# EAGLE design ESP-Live (EAGLE 7.7.0)
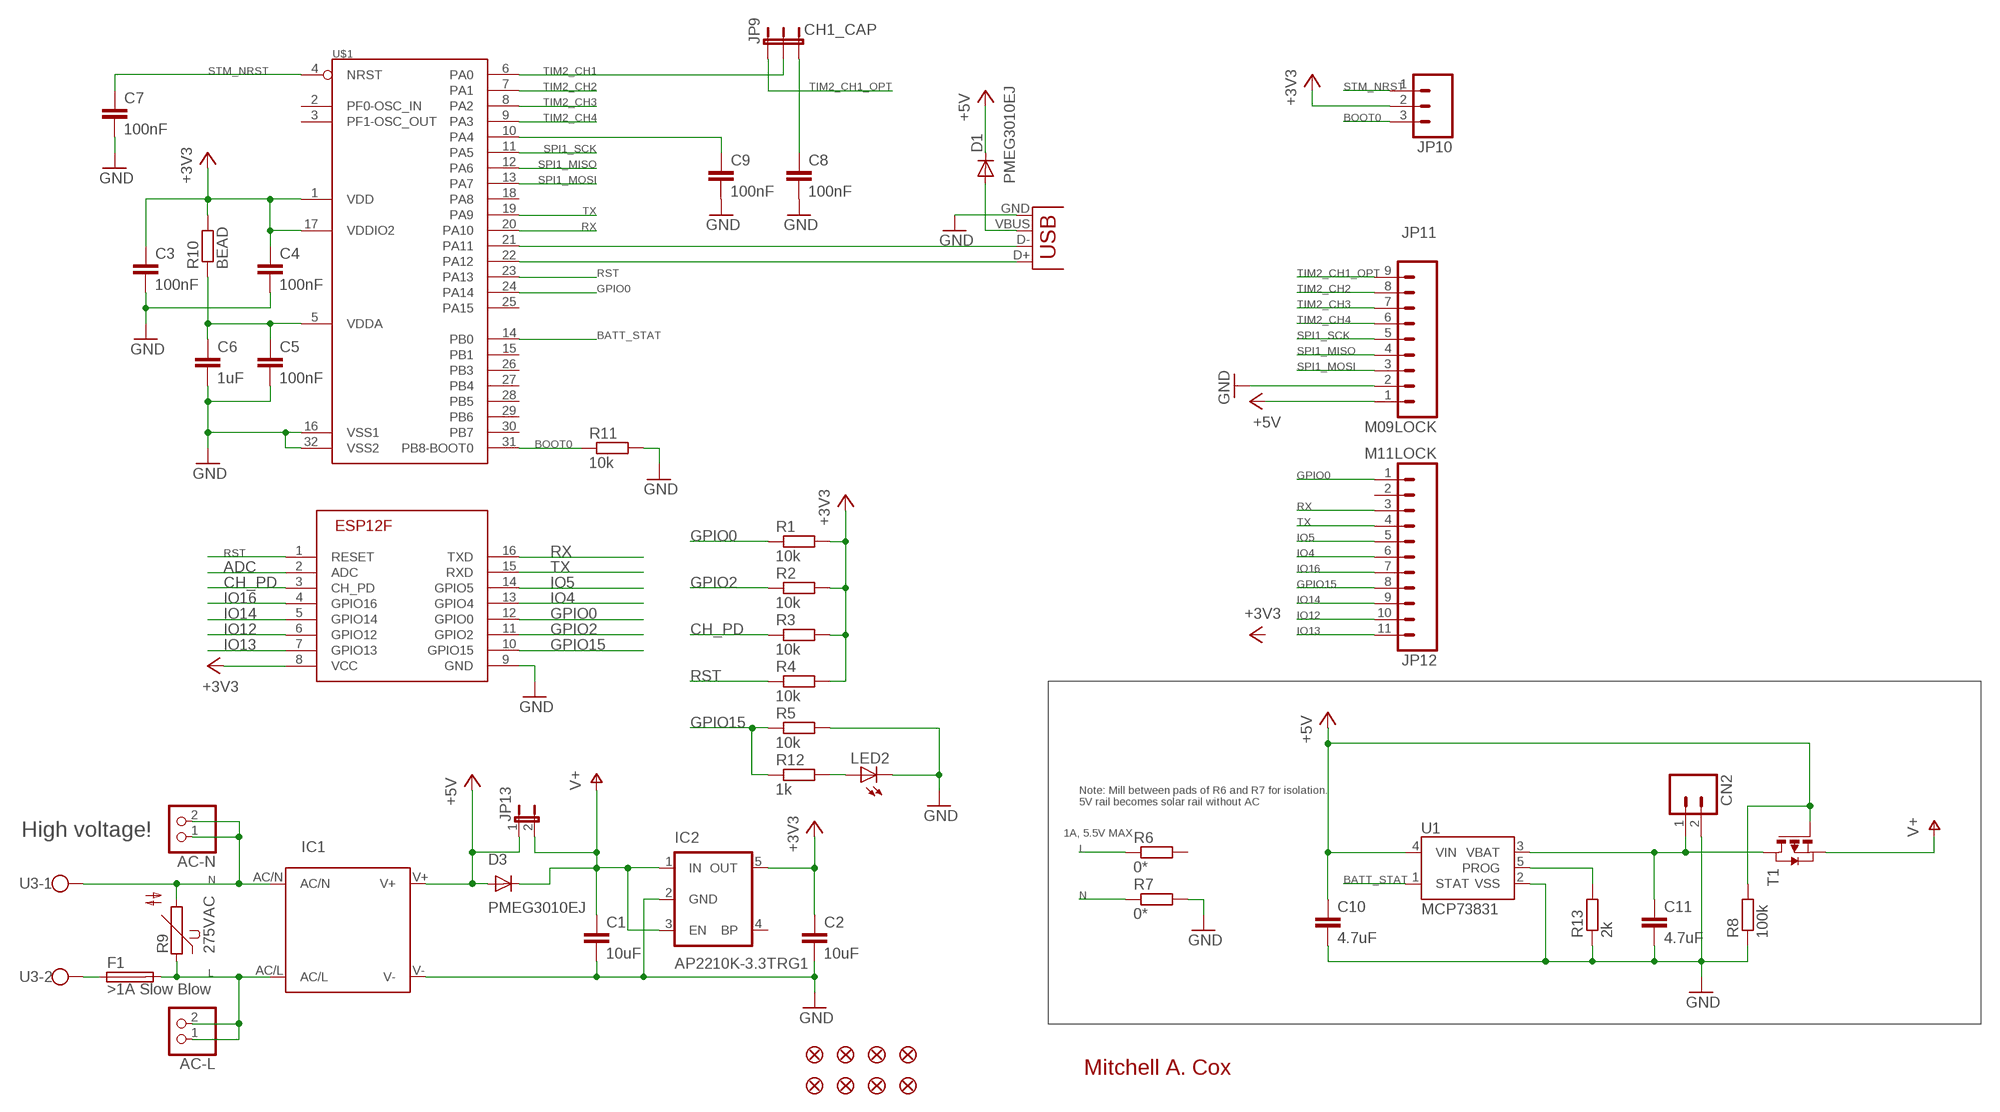
[diagram p0: schematic, sheet 1]

## Parts
AC-L  PINHD-1X2  [1X02]
AC-N  PINHD-1X2  [1X02]
C1  10uF  C-EUC0805  [C0805]
C2  10uF  C-EUC0805  [C0805]
C3  100nF  C-EUC0603  [C0603]
C4  100nF  C-EUC0603  [C0603]
C5  100nF  C-EUC0603  [C0603]
C6  1uF  C-EUC0805  [C0805]
C7  100nF  C-EUC0603  [C0603]
C8  100nF  C-EUC0603  [C0603]
C9  100nF  C-EUC0603  [C0603]
C10  4.7uF  C-EUC0805  [C0805]
C11  4.7uF  C-EUC0805  [C0805]
CN1  USBSMD  [USB-MINIB]
CN2  M02-JST-2-PTH-NO_SILK  [JST-2-PTH-NS]
D1  PMEG3010EJ  DIODESOD  [SOD-323]
D3  PMEG3010EJ  DIODESOD  [SOD-323]
F1  >1A Slow Blow  TE5  [TE5]
IC1  IRM_01/02_SMDIRM_01/02_SMD  [IRM_01/02_SMD]
IC2  AP2210K-3.3TRG1  V_REG_LDOSMD  [SOT23-5]
IC3  ESP-12F  [ESP-12F]
JP1  FIDUCIAL1X2  [FIDUCIAL-1X2]
JP2  FIDUCIAL1X2  [FIDUCIAL-1X2]
JP3  FIDUCIAL1X2  [FIDUCIAL-1X2]
JP4  FIDUCIAL1X2  [FIDUCIAL-1X2]
JP5  FIDUCIAL1X2  [FIDUCIAL-1X2]
JP6  FIDUCIAL1X2  [FIDUCIAL-1X2]
JP7  FIDUCIAL1X2  [FIDUCIAL-1X2]
JP8  FIDUCIAL1X2  [FIDUCIAL-1X2]
JP9  CH1_CAP  JUMPER-31-2  [SJ_3_PASTE1&2]
JP10  M03LOCK  [1X03_LOCK]
JP11  M09LOCK  [1X09_LOCK]
JP12  M11LOCK  [1X11_LOCK]
JP13  JUMPER-2SMD-NO  [SJ_2S-NO]
LED2  LEDCHIPLED_0805  [CHIPLED_0805]
R1  10k  R-EU_R0603  [R0603]
R2  10k  R-EU_R0603  [R0603]
R3  10k  R-EU_R0603  [R0603]
R4  10k  R-EU_R0603  [R0603]
R5  10k  R-EU_R0603  [R0603]
R6  0*  R-EU_R2512  [R2512]
R7  0*  R-EU_R2512  [R2512]
R8  100k  R-EU_R0603  [R0603]
R9  275VAC  P593  [P593]
R10  BEAD  R-EU_R0603  [R0603]
R11  10k  R-EU_R0603  [R0603]
R12  1k  R-EU_R0603  [R0603]
R13  2k  R-EU_R0603  [R0603]
T1  PMOSSOT23  [SOT-23]
U1  MCP73831  [SOT23-5]
U3  W237-102  [W237-102]
U$1  STM32F042K  [LQFP32]

## Nets
+3V3: C2.1 C3.1 C4.1 IC2.5(OUT) IC3.8(VCC) JP10.2 R1.2 R2.2 R3.2 R4.2 R10.2 U$1.1(VDD) U$1.17(VDDIO2)
+5V: C10.1 D1.1(C) D3.2(A) IC1.V+ JP11.1 JP13.1 R8.2 T1.3(G) U1.4(VIN)
ADC: IC3.2(ADC)
BATT_STAT: U1.1(STAT) U$1.14(PB0)
BOOT0: JP10.3 R11.1 U$1.31(PB8-BOOT0)
CH_PD: IC3.3(CH_PD) R3.1
GND: C1.2 C2.2 C3.2 C4.2 C5.2 C6.2 C7.2 C8.2 C9.2 C10.2 C11.2 CN1.GND CN2.2 IC1.V- IC2.2(GND) IC3.9(GND) JP11.2 LED2.C R5.2 R7.2 R8.1 R11.2 R13.1 U1.2(VSS) U$1.16(VSS1) U$1.32(VSS2)
GPIO0: IC3.12(GPIO0) JP12.1 R1.1 U$1.24(PA14)
GPIO2: IC3.11(GPIO2) R2.1
GPIO15: IC3.10(GPIO15) JP12.8 R5.1 R12.1
IO4: IC3.13(GPIO4) JP12.6
IO5: IC3.14(GPIO5) JP12.5
IO12: IC3.6(GPIO12) JP12.10
IO13: IC3.7(GPIO13) JP12.11
IO14: IC3.5(GPIO14) JP12.9
IO16: IC3.4(GPIO16) JP12.7
L: AC-L.1 AC-L.2 F1.2 IC1.AC/L R6.1 R9.1
N: AC-N.1 AC-N.2 IC1.AC/N R7.1 R9.2 U3.1
N$1: F1.1 U3.2
N$2: C5.1 C6.1 R10.1 U$1.5(VDDA)
N$3: R13.2 U1.5(PROG)
N$6: CN1.D- U$1.21(PA11)
N$7: CN1.D+ U$1.22(PA12)
N$9: CN1.VBUS D1.2(A)
N$10: LED2.A R12.2
N$11: C9.1 U$1.10(PA4)
N$12: C8.1 JP9.3
N$13: C11.1 CN2.1 T1.1(D) U1.3(VBAT)
RST: IC3.1(RESET) R4.1 U$1.23(PA13)
RX: IC3.16(TXD) JP12.3 U$1.20(PA10)
SPI1_MISO: JP11.4 U$1.12(PA6)
SPI1_MOSI: JP11.3 U$1.13(PA7)
SPI1_SCK: JP11.5 U$1.11(PA5)
STM_NRST: C7.1 JP10.1 U$1.4(NRST)
TIM2_CH1: JP9.2 U$1.6(PA0)
TIM2_CH1_OPT: JP9.1 JP11.9
TIM2_CH2: JP11.8 U$1.7(PA1)
TIM2_CH3: JP11.7 U$1.8(PA2)
TIM2_CH4: JP11.6 U$1.9(PA3)
TX: IC3.15(RXD) JP12.4 U$1.19(PA9)
V+: C1.1 D3.1(C) IC2.1(IN) IC2.3(EN) JP13.2 T1.2(S)
Unconnected: IC2.4(BP) JP12.2 R6.2 U$1.2(PF0-OSC_IN) U$1.3(PF1-OSC_OUT) U$1.15(PB1) U$1.18(PA8) U$1.25(PA15) U$1.26(PB3) U$1.27(PB4) U$1.28(PB5) U$1.29(PB6) U$1.30(PB7)

## Notes on the sheet
- Note: Mill between pads of R6 and R7 for isolation.
  5V rail becomes solar rail without AC
- High voltage! | 1A, 5.5V MAX
- Mitchell A. Cox

## Library data of the parts
AC-L AC-N = pinhead:PINHD-1X2: PIN HEADER
C1-C11 = rcl:C-EU: CAPACITOR, European symbol
CN1 = SparkFun:USB: USB Connectors USB-B-PTH is fully proven SKU : PRT-00139 USB-miniB is fully proven SKU : PRT-00587 USB-A-PCB is untested. USB-A-H is throughly reviewed, but untested. Spark Fun Electronics SKU : PRT-00437 USB-B-SMT is throughly reviewed, but untested. Needs silkscreen touching up. USB-A-S has not been used/tested USB-MB-H has not been used/tested
CN2 = SparkFun:M02: Header 2 Standard 2-pin 0.1" header. Use with straight break away headers (SKU : PRT-00116), right angle break away headers (PRT-00553), swiss pins (PRT-00743), machine pins (PRT-00117), and female headers (PRT-00115). Molex polarized connector foot print use with SKU : PRT-08233 with associated crimp pins and housings.
D1 D3 = SparkFun:DIODE: Diode These are standard reverse protection diodes and small signal diodes. SMA package can handle up to about 1A. SOD-323 can handle about 200mA. What the SOD-323 package when ordering, there are some mfgs out there that are 5-pin packages.
F1 = fuse:TE5: FUSE Wickmann; OC_FARNELL: unknown; OC_NEWARK: unknown
IC1 = meanwell_irm_v7:IRM_01/02_SMD: 1 or 2 watt housing & pin compatible IRM 01 Vout [V] Imax [A] Pmax [W] Eff [%] 3.3 0.3 1 66 5 0.2 1 70 9 0.111 1 72 12 0.083 1 74 15 0.067 1 75 24 0.042 1 77 IRM 2 Vout [V] Imax [A] Pmax [W] Eff [%] 3.3 0.6 2 66 5 0.4 2 70 9 0.222 2 72 12 0.167 2 74 15 0.133 2 75 24 0.087 2 77
IC2 = SparkFun:V_REG_LDO: Voltage Regulator LDO Standard 150mA LDO voltage regulator in SOT-23 layout. Micrel part MIC5205. BP (by-pass) pin is used to lower output noise with 470pF cap.
IC3 = adafruit:ESP-12F
JP1-JP8 = SparkFun:FIDUCIAL: Fiducial Alignment Points Various fiducial points for machine vision alignment.
JP9 = SparkFun:JUMPER-3
JP10 = SparkFun:M03: Header 3 Standard 3-pin 0.1" header. Use with straight break away headers (SKU : PRT-00116), right angle break away headers (PRT-00553), swiss pins (PRT-00743), machine pins (PRT-00117), and female headers (PRT-00115). Molex polarized connector foot print use with SKU : PRT-08232 with associated crimp pins and housings.
JP11 = SparkFun:M09: Header 9 Standard 9-pin 0.1" header. Use with straight break away headers (SKU : PRT-00116), right angle break away headers (PRT-00553), swiss pins (PRT-00743), machine pins (PRT-00117), and female headers (PRT-00115).
JP12 = SparkFun:M11: Header 11 Standard 11-pin 0.1" header. Use with straight break away headers (SKU : PRT-00116), right angle break away headers (PRT-00553), swiss pins (PRT-00743), machine pins (PRT-00117), and female headers (PRT-00115).
JP13 = SparkFun:JUMPER-2: Jumper Basic 0.1" spaced jumper. Use with breakaway headers.
LED2 = adafruit:LED: LED OSRAM: - CHIPLED LG R971, LG N971, LY N971, LG Q971, LY Q971, LO R971, LY R971 LH N974, LH R974 LS Q976, LO Q976, LY Q976 LO Q996 - Hyper CHIPLED LW Q18S LB Q993, LB Q99A, LB R99A - SideLED LS A670, LO A670, LY A670, LG A670, LP A670 LB A673, LV A673, LT A673, LW A673 LH A674 LY A675 LS A676, LA A676, LO A676, LY A676, LW A676 LS A679, LY A679, LG A679 - Hyper Micro SIDELED® LS Y876, LA Y876, LO Y876, LY Y876 LT Y87S - SmartLED LW L88C, LW L88S LB L89C, LB L89S, LG L890 LS L89K, LO L89K, LY L89K LS L896, LA L896, LO L896, LY L896 - TOPLED LS T670, LO T670, LY T670, LG T670, LP T670 LSG T670, LSP T670, LSY T670, LOP T670, LYG T670 LG T671, LOG T671, LSG T671 LB T673, LV T673, LT T673, LW T673 LH T674 LS T676, LA T676, LO T676, LY T676, LB T676, LH T676, LSB T676, LW T676 LB T67C, LV T67C, LT T67C, LS T67K, LO T67K, LY T67K, LW E67C LS E67B, LA E67B, LO E67B, LY E67B, LB E67C, LV E67C, LT E67C LW T67C LS T679, LY T679, LG T679 LS T770, LO T770, LY T770, LG T770, LP T770 LB T773, LV T773, LT T773, LW T773 LH T774 LS E675, LA E675, LY E675, LS T675 LS T776, LA T776, LO T776, LY T776, LB T776 LHGB T686 LT T68C, LB T68C - Hyper Mini TOPLED® LB M676 - Mini TOPLED Santana® LG M470 LS M47K, LO M47K, LY M47K Source: http://www.osram.convergy.de/
R1-R8 R10-R13 = rcl:R-EU_: RESISTOR, European symbol
R9 = varistor:P593: VARISTOR
T1 = zetex:PMOSSOT23: MOS FET; OC_FARNELL: unknown; OC_NEWARK: unknown
U1 = SparkFun:MCP73831: Microchip's MCP73831 Miniature single cell, fully integrated Li-Ion, Li-polymer charge management controller http://ww1.microchip.com/downloads/en/DeviceDoc/21984a.pdf
U3 = con-wago-500:W237-102: WAGO SCREW CLAMP; MPN: 237-102; OC_FARNELL: unknown; OC_NEWARK: 70K9898
U$1 = stm32:STM32F042K

## Board
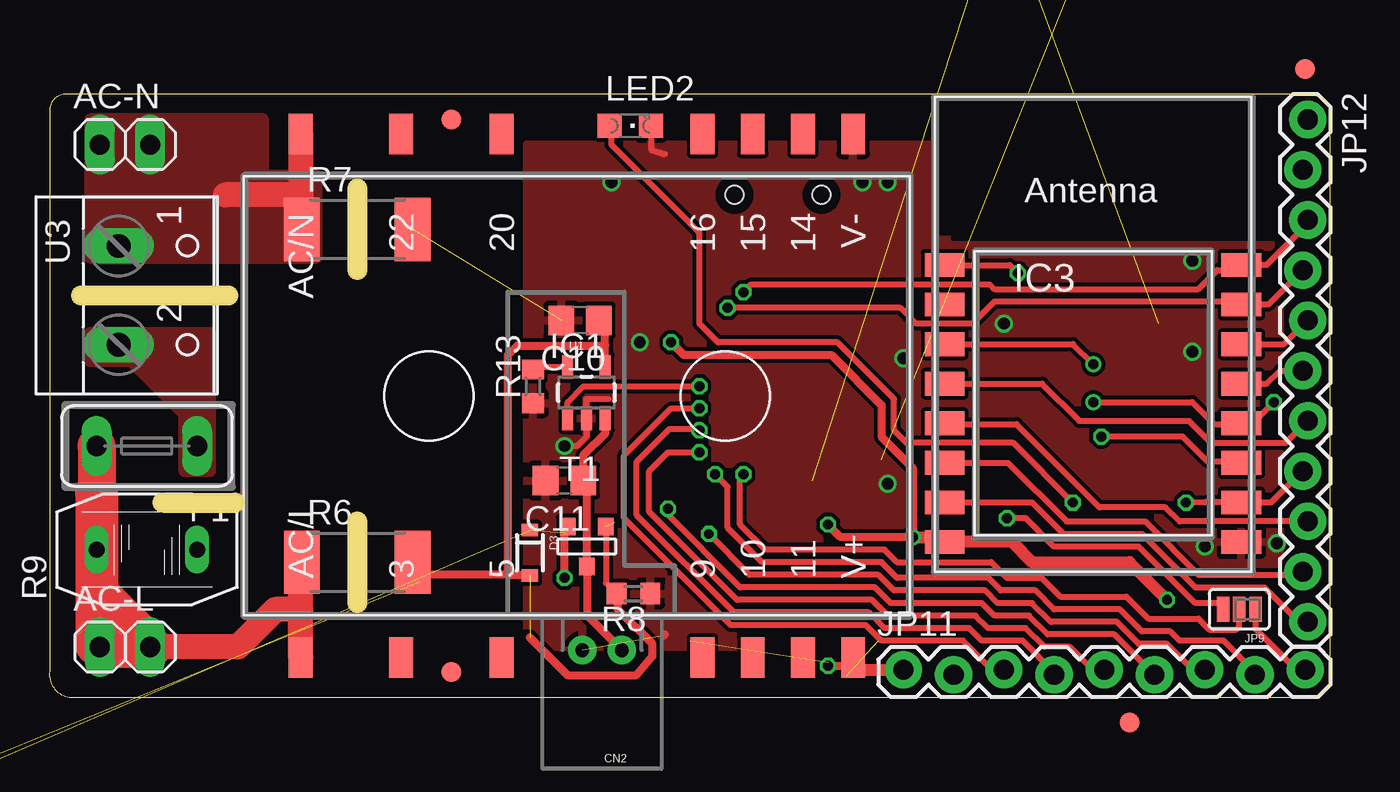
[diagram p1: board, top side]
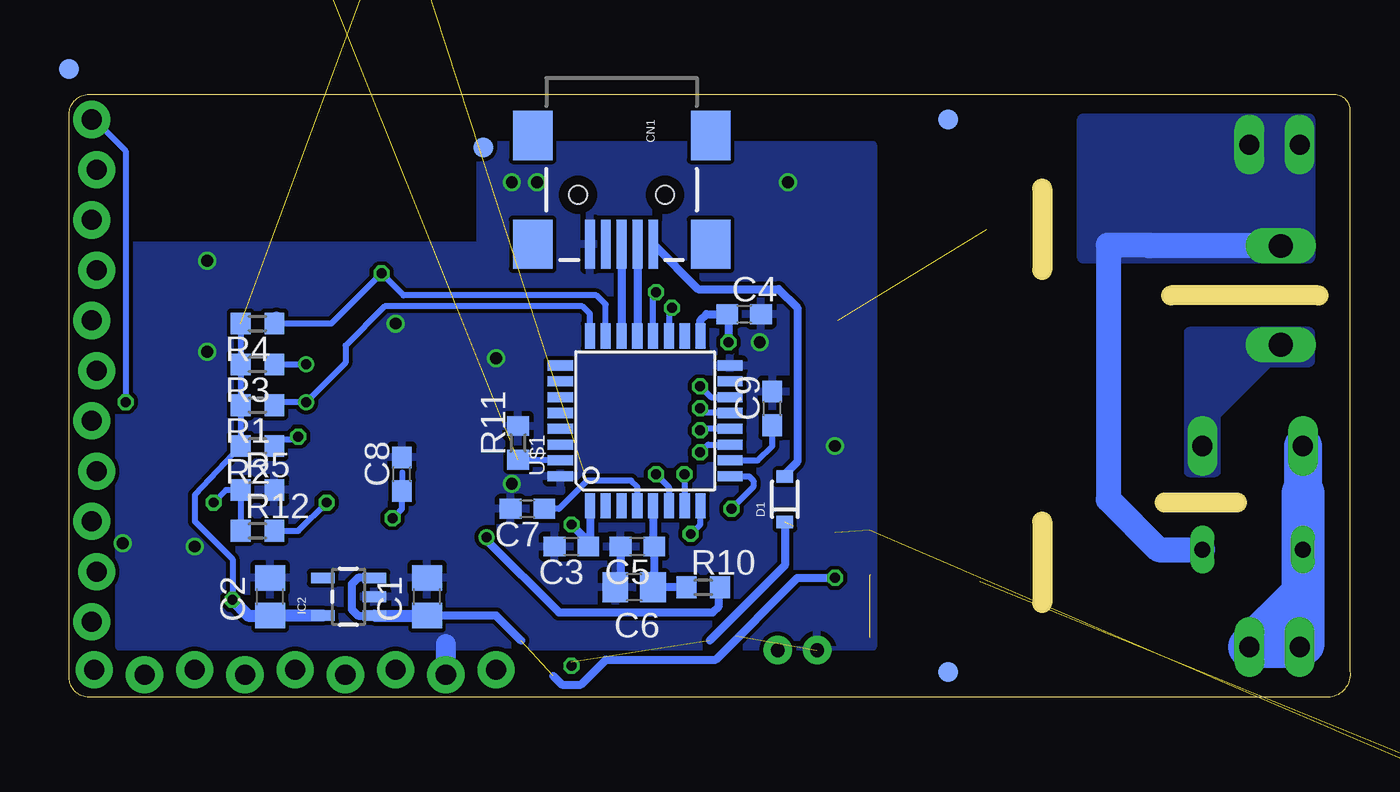
[diagram p2: board, bottom side, seen from below]

Size 64.78 x 30.49 mm. Coordinates in mm from the lower left corner, seen from the top.
Outline: 63.78,30.48 1.01,30.48 arc90 0.01,29.8 0.01,1.32 arc90 1.01,0 63.78,0 arc90 64.78,1 64.78,29.48 arc90 63.78,30.48
Copper layers (1*16): Top 0.035mm / dielectric 1.6mm / Bottom 0.035mm
Design rules "Elecrow_2-layer_PCB_eagle_rule *": minimum track width 6mil, minimum drill 12mil, track to track 8mil, track to pad 8mil, pad to pad 8mil, via to via 8mil, smd to smd 0mil, copper to edge 20mil, drill to drill 12mil, minimum pad ring 6mil, minimum via ring 6mil, stop-mask expansion 0mil, vias tented up to drill 100mil, thermal gap 10mil
tKeepout: area -4.3,14.6 to -1.3,17.6
Milling: 4 lines

### Footprints (pad centres in the part's own frame; a part is rotated, then mirrored left to right if it is on the bottom)
1X02 = drill 1.016 long: 1 -1.27,0; 2 1.27,0
C0805 = smd 1.3 x 1.5: 1 -0.95,0; 2 0.95,0
C0603 = smd 1.1 x 1: 1 -0.85,0; 2 0.85,0
USB-MINIB = smd 2.5 x 0.5: D+ 2.5,0; D- 2.5,0.8; GND 2.5,-1.6; ID 2.5,-0.8; VBUS 2.5,1.6 | smd 2.5 x 2: MTN1 -3,4.5; MTN2 2.5,4.5; MTN3 -3,-4.5; MTN4 2.5,-4.5 | hole 0.9: 0,2.2; 0,-2.2
JST-2-PTH-NS = drill 0.7 pad 1.448: 1 -1,0; 2 1,0
SOD-323 = smd 0.63 x 0.83: 1 -1.15,0; 2 1.15,0
TE5 = drill 1.016 long: 1 -2.54,0; 2 2.54,0
IRM_01/02_SMD = smd 1.2 x 2.03: AC/L -13.97,-13.235; AC/N -13.97,13.235; P$3 -8.89,-13.235; P$5 -3.81,-13.235; P$9 6.35,-13.235; P$10 8.89,-13.235; P$11 11.43,-13.235; P$14 11.43,13.235; P$15 8.89,13.235; P$16 6.35,13.235; P$20 -3.81,13.235; P$22 -8.89,13.235; V+ 13.97,-13.235; V- 13.97,13.235
SOT23-5 = smd 0.55 x 1.2: 1 -0.95,-1.3; 2 0,-1.3; 3 0.95,-1.3; 4 0.95,1.3; 5 -0.95,1.3
ESP-12F = smd 2 x 1.2: 1 0.5,15.5; 2 0.5,13.5; 3 0.5,11.5; 4 0.5,9.5; 5 0.5,7.5; 6 0.5,5.5; 7 0.5,3.5; 8 0.5,1.5; 9 15.5,1.5; 10 15.5,3.5; 11 15.5,5.5; 12 15.5,7.5; 13 15.5,9.5; 14 15.5,11.5; 15 15.5,13.5; 16 15.5,15.5
FIDUCIAL-1X2 = smd 1 x 1: 1 0,0
SJ_3_PASTE1&2 = smd 0.635 x 1.27: 1 -0.813,0; 2 0,0; 3 0.813,0
1X03_LOCK = drill 1.016 pad 1.88: 1 0,0.127; 2 2.54,-0.127; 3 5.08,0.127
1X09_LOCK = drill 1.016 pad 1.88: 1 0,0.127; 2 2.54,-0.127; 3 5.08,0.127; 4 7.62,-0.127; 5 10.16,0.127; 6 12.7,-0.127; 7 15.24,0.127; 8 17.78,-0.127; 9 20.32,0.127
1X11_LOCK = drill 1.016 pad 1.88: 1 0,0.127; 2 2.54,-0.127; 3 5.08,0.127; 4 7.62,-0.127; 5 10.16,0.127; 6 12.7,-0.127; 7 15.24,0.127; 8 17.78,-0.127; 9 20.32,0.127; 10 22.86,-0.127; 11 25.4,0.127
SJ_2S-NO = smd 0.635 x 1.27: 1 -0.45,0; 2 0.45,0
CHIPLED_0805 = smd 1.2 x 1.2: A 0,-1.05; C 0,1.05
R0603 = smd 1 x 1.1: 1 -0.85,0; 2 0.85,0
R2512 = smd 1.8 x 3.2: 1 -2.8,0; 2 2.8,0
P593 = drill 0.813 long: 1 0,2.54; 2 0,-2.54
SOT-23 = smd 0.787 x 0.889: 1 0.025,-1.016; 2 -0.94,1.016; 3 0.991,1.016
W237-102 = drill 1.194 long: 1 -2.5,-1.27; 2 2.5,-1.27
LQFP32 = smd 1.27 x 0.508: 1 -4.293,2.8; 2 -4.293,2; 3 -4.293,1.2; 4 -4.293,0.4; 5 -4.293,-0.4; 6 -4.293,-1.2; 7 -4.293,-2; 8 -4.293,-2.8; 17 4.293,-2.8; 18 4.293,-2; 19 4.293,-1.2; 20 4.293,-0.4; 21 4.293,0.4; 22 4.293,1.2; 23 4.293,2; 24 4.293,2.8 | smd 0.508 x 1.27: 9 -2.8,-4.293; 10 -2,-4.293; 11 -1.2,-4.293; 12 -0.4,-4.293; 13 0.4,-4.293; 14 1.2,-4.293; 15 2,-4.293; 16 2.8,-4.293; 25 2.8,4.293; 26 2,4.293; 27 1.2,4.293; 28 0.4,4.293; 29 -0.4,4.293; 30 -1.2,4.293; 31 -2,4.293; 32 -2.8,4.293

### Placement (x,y rotation side)
AC-L  3.82,2.54 0 top
AC-N  3.82,27.94 0 top
C1  46.68,5.08 90 bottom
C2  54.62,5.08 90 bottom
C3  39.38,7.62 180 bottom
C4  30.65,19.37 0 bottom
C5  36.05,7.62 180 bottom
C6  36.2,5.56 180 bottom
C7  41.6,9.53 180 bottom
C8  47.95,11.27 90 bottom
C9  29.22,14.6 90 bottom
C10  26.84,19.05 180 top
C11  26.04,10.95 180 top
CN1  36.84,25.4 270 bottom
CN2  27.95,2.38 180 top
D1  28.58,10 90 bottom
D3  24.3,7.3 270 top
F1  4.93,12.7 180 top
IC1  26.68,15.24 0 top
IC2  50.65,5.08 90 bottom
IC3  44.78,6.35 0 top
JP1  20.33,1.27 0 top
JP2  20.33,29.21 0 top
JP3  63.51,31.75 0 top
JP4  54.62,-1.27 0 top
JP5  64.78,31.75 0 bottom
JP6  20.33,29.21 0 bottom
JP7  43.82,27.78 0 bottom
JP8  20.33,1.27 0 bottom
JP9  60.18,4.45 180 top
JP10  47,36.83 0 top  (outside the outline)
JP11  43.19,1.27 0 top
JP12  63.51,29.21 270 top
JP13  -7.61,-5.08 0 top  (outside the outline)
LED2  29.38,28.89 270 top
R1  55.25,14.76 180 bottom
R2  55.25,12.7 180 bottom
R3  55.25,16.83 180 bottom
R4  55.25,18.89 180 bottom
R5  55.25,10.48 0 bottom
R6  15.57,6.83 0 top
R7  15.57,23.65 0 top
R8  29.54,5.24 180 top
R9  4.93,7.46 90 top
R10  32.71,5.56 0 bottom
R11  42.08,12.86 90 bottom
R12  55.25,8.41 0 bottom
R13  24.46,15.72 90 top
T1  27.16,7.62 0 top
U1  27.16,15.4 0 top
U3  4.77,20.32 270 top
U$1  35.65,13.97 90 bottom

### Tracks (layer width: path | path; a pad name or v marks a point on that pad's centre or on a via)
+3V3  (via drill 0.5)  (1 unrouted)
  Top 0.406: v31.44,17.94 32.08,17.3 39.54,17.3 42.08,14.76 42.08,13.18 43.67,11.59 v43.67,8.1 40.01,8.1 v39.38,8.73
  Top 0.61: v56.52,4.92 54.62,6.83 49.7,6.83 48.67,7.85 IC3.8 45.03,8.1 v43.67,8.1
  Bottom 0.305: R4.2 R3.2 R1.2 R2.2 58.43,10.22 58.43,8.89 56.52,6.98 v56.52,4.92
  Bottom 0.406: v43.67,8.1 43.67,7.94 40.01,4.29 32.24,4.29 31.92,4.6 31.92,5.5 R10.2 | U$1.17 32.85,19.07 32.55,19.37 C4.1 31.44,19.31 v31.44,17.94 | 38.45,7.7 38.51,7.7 | U$1.1 38.45,7.7 | 38.45,7.7 C3.1 38.53,7.88 v39.38,8.73
  Bottom 0.61: IC2.5 C2.1 55.73,4.13 v56.52,4.92
+5V  (via drill 0.5)  (5 unrouted)
  Top 0.305: T1.3 28.15,5.78 R8.2
  Top 0.406: v39.38,1.59 40.43,1.59 40.78,1.4 | U1.4 28.11,17.78 | 28.11,17.78 28.11,18.73 C10.1 | 18.72,5.83 18.6,6.18 18.6,6.19 23.19,6.19 | 23.19,6.19 23.19,17.3 23.66,17.78 28.11,17.78 | 24.3,3.02 26.2,1.11 29.7,1.11 30.49,2.06 30.49,2.7 28.74,4.45 28.74,5.24 R8.2 | 23.19,6.19 24.26,6.19
  Top 0.61: IC1.V+ 40.78,1.4 JP11.1
  Bottom 0.406: 43.16,1.43 JP11.1 | D1.1 28.58,6.67 32.39,2.86 | 39.41,1.77 v39.38,1.59
BATT_STAT  (via drill 0.5)
  Top 0.305: U1.1 26.21,14.92 27,15.72 v32.87,15.72
  Bottom 0.305: v32.87,15.72 32.32,15.17 U$1.14
BOOT0  (1 unrouted)
  Bottom 0.305: U$1.31 42.04,11.97 R11.1
CH_PD  (via drill 0.5)
  Top 0.305: IC3.3 51.77,17.85 v52.79,16.83
  Bottom 0.305: R3.1 v52.79,16.83
GND  (via drill 0.6)  (2 unrouted)
  Top 0.305: LED2.C 30.43,27.68 31.12,27.46 | v26.04,12.7 26.68,12.7 27.16,13.18 U1.2 27.16,15.08 28.27,15.08
  Top 0.406: 31.06,3.11 31.12,3.18
  Top 0.813: 60.75,7.69 IC3.9
  Bottom 0.406: C5.2 36.9,5.81 C6.2
  Bottom 1.016: JP11.2 45.73,2.7
  other vias: 58.43,7.62 62.08,7.78 57.79,17.46 48.27,18.89 57.79,22.07 41.13,26.04 42.4,26.04 43.19,17.14 29.85,17.94 28.43,26.04 42.4,10.79
  pour Bottom: 24.14,27.94 24.14,2.54 62.24,2.54 62.24,22.86 43.98,22.86 43.98,27.94
  pour Top: 24.14,27.94 24.14,2.54 62.24,2.54 62.24,22.86 45.41,22.86 45.41,27.94
GPIO0  (via drill 0.5)
  Top 0.305: v52.79,14.92 57.79,14.92 58.91,13.81 60.56,13.81 | 60.56,13.81 IC3.12 | v61.92,14.92 60.81,13.81 60.56,13.81
  Top 0.406: IC3.12 60.93,13.85
  Bottom 0.305: U$1.24 38.45,19.39 38.82,19.76 48.83,19.76 50.81,17.78 50.81,16.91 v52.79,14.92 54.25,14.92 | JP12.1 63.51,29.21 61.92,27.62 v61.92,14.92 | 54.25,14.92 R1.1 arc90 54.25,14.92
GPIO2  (via drill 0.5)
  Top 0.305: IC3.11 60.22,11.91 58.59,11.91 57.32,13.18 v53.19,13.18
  Bottom 0.305: v53.19,13.18 53.19,13.02 54.3,13.02 R2.1
GPIO15  (via drill 0.5)
  Top 0.305: v57.48,9.84 58.44,9.85 IC3.10 61.76,9.84 63.35,11.43 JP12.8
  Top 0.406: IC3.10 60.96,9.85
  Bottom 0.305: R12.1 R5.1 56.84,10.48 v57.48,9.84
IO4
  Top 0.305: IC3.13 61.58,15.85 62.24,16.51 JP12.6
IO5
  Top 0.305: IC3.14 62.44,17.85 JP12.5
IO12
  Top 0.305: IC3.6 48.48,11.85 51.44,8.89 55.41,8.89 58.11,6.19 63.22,6.19 JP12.10
IO13
  Top 0.305: IC3.7 49.69,9.85 51.29,8.25 55.25,8.25 57.95,5.56 61.45,5.56 63.19,3.81 JP12.11
IO14
  Top 0.305: IC3.5 45.29,13.85 45.57,13.81 48.9,13.81 53.11,9.6 56.45,9.6 57.16,8.89 JP12.9
IO16
  Top 0.305: IC3.4 50.2,15.85 52.08,13.97 57.64,13.97 58.75,12.86 62.53,12.86 JP12.7
L
  Top 1.27: 12.71,4.45 12.71,7.24 R6.1 | IC1.AC/L 12.71,4.45 | 12.71,4.45 11.44,4.45 9.53,2.54 AC-L.2
  Top 1.93: F1.2 2.39,10.32
  Top 2.184: 2.39,10.32 2.39,2.7 AC-L.1 AC-L.2 2.55,5.08
  Bottom 1.93: F1.2 2.39,10.32
  Bottom 2.184: 2.39,10.32 R9.1 2.39,2.7 AC-L.1 AC-L.2 2.55,5.08
N
  Top 1.27: IC1.AC/N 12.71,25.4 8.9,25.4
  Bottom 1.27: U3.1 10.13,22.82 10.17,22.86 12.23,22.86 12.23,10 9.69,7.46 R9.2
  pour Bottom (no thermals): 2.07,29.21 2.07,22.23 13.5,22.23 13.5,29.21
  pour Top (no thermals): 2.07,29.21 2.07,22.23 13.5,22.23 13.5,26.35 10.8,26.35 10.8,29.21
N$1
  pour Bottom (no thermals): 2.07,18.42 8.11,18.42 8.11,11.43 6.84,11.43 6.84,14.29 4.14,16.99 2.07,16.99
  pour Top (no thermals): 2.07,18.42 8.11,18.42 8.11,11.43 6.84,11.43 6.84,14.29 4.14,16.99 2.07,16.99
N$2
  Bottom 0.406: U$1.5 35.25,7.67 C5.1 35.2,5.62 C6.1 R10.1
N$3
  Top 0.305: R13.2 24.59,16.7 U1.5
N$6
  Bottom 0.406: CN1.D- U$1.21
N$7
  Bottom 0.406: CN1.D+ U$1.22
N$9
  Bottom 0.406: CN1.VBUS 32.98,20.64 28.9,20.64 27.95,19.69 27.95,11.91 28.58,11.27 D1.2
N$10  (via drill 0.5)
  Top 0.305: v51.76,9.84 48.75,12.86 43.35,12.86 42.71,13.49 42.71,15.08 39.86,17.94 33.82,17.94 32.87,18.89 32.87,23.5 28.43,27.94 28.43,28.79 LED2.A
  Bottom 0.305: R12.2 53.19,8.41 v51.76,9.84
N$11
  Bottom 0.305: U$1.10 29.95,11.97 29.22,12.7 C9.1
N$12  (via drill 0.5)
  Top 0.305: JP9.3 59.36,4.76 57.95,4.76 55.1,7.62 50.81,7.62 49.38,9.05 v48.43,9.05
  Bottom 0.305: 47.93,11.35 C8.1 47.95,9.53 v48.43,9.05
N$13
  Top 0.406: U1.3 28.11,13.33 26.99,12.22 C11.1 27.18,11.08 T1.1 27.18,4.15 CN2.1 28.95,2.49
RST  (via drill 0.5)
  Top 0.305: IC3.1 48.57,21.85 v48.98,21.43
  Bottom 0.305: R4.1 51.52,18.89 v48.98,21.43 47.87,20.32 38.11,20.32 37.65,19.86 U$1.23
  Bottom 0.61: R4.1 54.3,19.21
RX  (via drill 0.5)
  Top 0.254: IC3.16 59.7,21.85 59.7,21.59 61.1,21.59 | 63.64,23.94 JP12.3
  Top 0.305: v35.09,20.48 35.49,20.88 47.56,20.88 47.79,20.64 58.11,20.64 59.06,21.59 60.02,21.59 IC3.16 61.55,21.85 63.64,23.94
  Top 0.406: IC3.16 60.59,21.85 60.85,21.59
  Bottom 0.254: U$1.20 | 35.25,20.32 v35.09,20.48
  Bottom 0.305: U$1.20 35.25,20.32
SPI1_MISO  (via drill 0.5)
  Top 0.305: JP11.4 50.81,1.27 49.22,2.86 47.16,2.86 46.52,3.49 42.24,3.49 41.44,4.29 34.62,4.29 29.7,9.21 29.7,11.91 U$1.12 32.95,13.57 v32.87,13.49
  Bottom 0.305: U$1.12 32.79,13.57 v32.87,13.49
SPI1_MOSI  (via drill 0.5)
  Top 0.305: v32.87,14.6 31.44,14.6 29.06,12.22 29.06,9.05 34.46,3.65 41.28,3.65 42.08,2.86 46.21,2.86 47.67,1.4 JP11.3
  Bottom 0.305: U$1.13 32.79,14.37 v32.87,14.6
SPI1_SCK  (via drill 0.5)
  Top 0.305: JP11.5 52.75,1.4 51.6,2.54 50.33,2.54 49.38,3.49 47.48,3.49 46.84,4.13 42.4,4.13 41.6,4.92 34.78,4.92 30.33,9.37 30.33,11.43 31.28,12.38 v32.87,12.38
  Bottom 0.305: v32.87,12.38 32.46,12.77 U$1.11
STM_NRST  (1 unrouted)
  Bottom 0.305: U$1.4 36.05,10.64 36.36,10.95 38.59,10.95 40.01,9.53 C7.1
TIM2_CH1  (via drill 0.5)
  Top 0.305: v35.09,11.27 34.93,11.11 34.93,8.73 36.2,7.46 42.24,7.46 42.87,6.83 47.63,6.83 48.43,6.03 50.17,6.03 51.13,5.08 54.46,5.08 55.57,3.97 58.11,3.97 58.67,3.41 60.02,3.41 60.18,3.57 JP9.2
  Bottom 0.305: v35.09,11.27 34.45,10.63 U$1.6
TIM2_CH1_OPT
  Top 0.305: JP9.1 60.99,3.47 63.07,1.4 JP11.9
TIM2_CH2  (via drill 0.5)
  Top 0.305: JP11.8 60.97,1.27 59.38,2.86 57.16,2.86 56.68,3.33 55.25,3.33 54.14,4.45 50.81,4.45 49.86,5.4 48.11,5.4 47.48,6.03 42.87,6.03 42.08,6.83 36.05,6.83 34.3,8.57 34.3,10.64 v33.66,11.27
  Bottom 0.305: v33.66,11.27 33.66,9.69 U$1.7
TIM2_CH3  (via drill 0.5)
  Top 0.305: JP11.7 57.83,1.4 56.52,2.7 55.1,2.7 53.98,3.81 50.65,3.81 49.7,4.76 47.95,4.76 47.32,5.4 42.71,5.4 41.92,6.19 35.41,6.19 v33.35,8.25
  Bottom 0.305: U$1.8 32.87,9.66 32.87,8.73 v33.35,8.25
TIM2_CH4  (via drill 0.5)
  Top 0.305: JP11.6 53.86,3.18 50.49,3.18 49.54,4.13 47.79,4.13 47.16,4.76 42.55,4.76 41.76,5.56 34.93,5.56 31.12,9.37 v31.28,9.53
  Bottom 0.305: U$1.9 30.39,11.17 30.17,10.95 30.17,10.64 v31.28,9.53
TX  (via drill 0.5)
  Top 0.254: 60.91,19.84 60.75,20
  Top 0.305: 60.75,20 47.79,20 46.68,18.89 43.82,18.89 43.03,19.69 v34.3,19.69 | JP12.4 61.64,19.84 60.91,19.84
  Top 0.61: 60.75,20 IC3.15
  Bottom 0.254: v34.3,19.69 34.45,19.54
  Bottom 0.305: 34.45,19.54 U$1.19
V+  (via drill 0.5)  (3 unrouted)
  Top 0.356: 26.24,8.45 T1.2
  Top 0.406: v26.04,6.03 26.04,8.31 T1.2
  Bottom 0.406: IC2.3 50.18,6.03 50.49,5.71 50.49,4.45 50.17,4.13 IC2.1 | 41.92,2.86 43.19,4.13 C1.1 | 40.31,1.08 39.86,0.64 38.9,0.64 37.63,1.9 32.08,1.9 27.95,6.03 v26.04,6.03
  Bottom 0.61: IC2.1 C1.1

### Text on the board
tDocu: v2.0 | N | IRM-01/02-5 | ESP-Live | TX | BATTERY | RX | IO5 | IO4 | IO0 | ESP-12F | IO2 | IO15 | ManCave Made | RST | 5V | GND | 3.3V | IO13 | IO12 | IO14 | IO16 | CH_PD | ADC | L
bDocu: 64.77x30.48mm / 0.05in Grid | High Voltage! | 85-250 VAC | ESP-Live v2.0 | ManCave Made | .